# EAGLE design Servos Board (EAGLE 6.5.0)
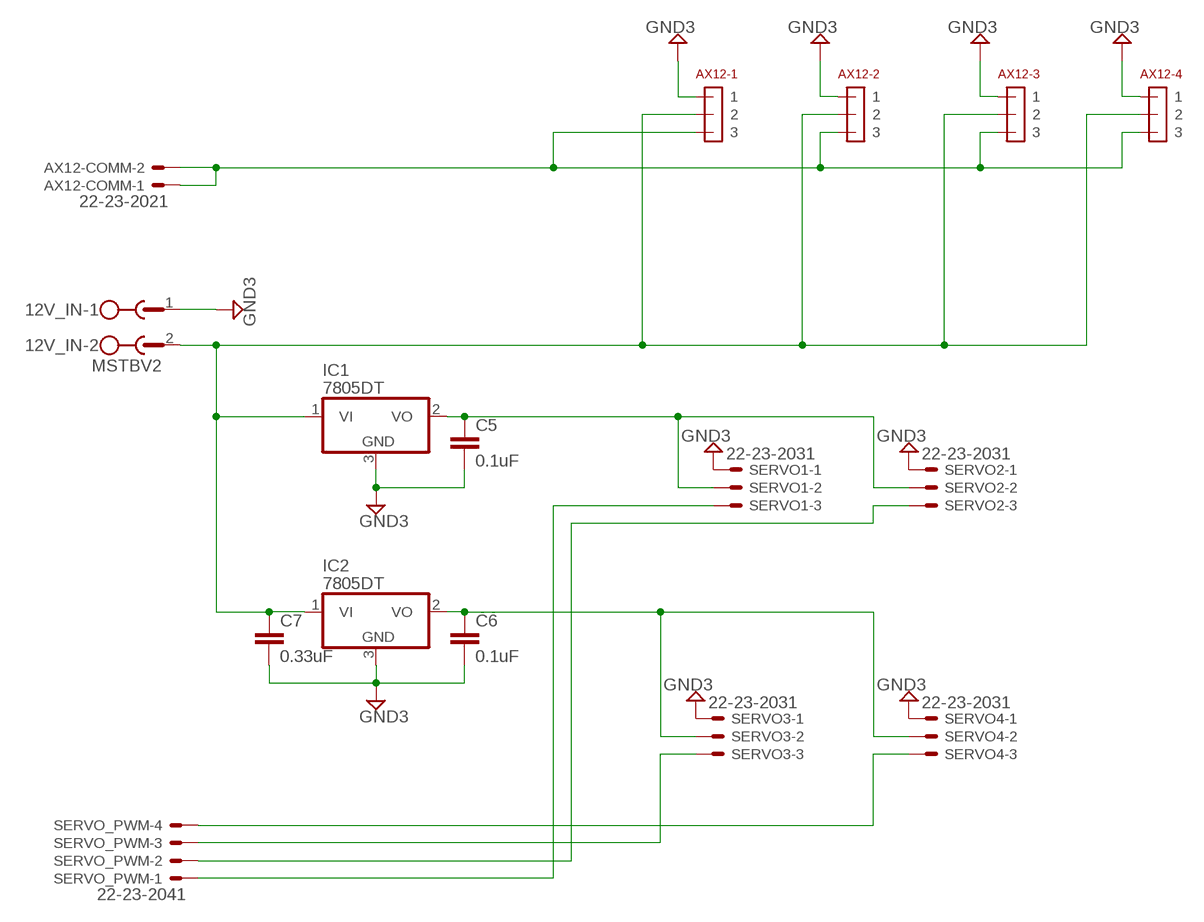
[diagram p0: schematic, sheet 1]

## Parts
12V_IN  MSTBV2  [MSTBV2]
AX12-1  22-03-5035  [22-03-5035]
AX12-2  22-03-5035  [22-03-5035]
AX12-3  22-03-5035  [22-03-5035]
AX12-4  22-03-5035  [22-03-5035]
AX12-COMM  22-23-2021  [22-23-2021]
C5  0.1uF  C-EUC0603  [C0603]
C6  0.1uF  C-EUC0603  [C0603]
C7  0.33uF  C-EUC0603  [C0603]
IC1  7805DT  [TO252]
IC2  7805DT  [TO252]
SERVO1  22-23-2031  [22-23-2031]
SERVO2  22-23-2031  [22-23-2031]
SERVO3  22-23-2031  [22-23-2031]
SERVO4  22-23-2031  [22-23-2031]
SERVO_PWM  22-23-2041  [22-23-2041]

## Nets
GND3: 12V_IN.1 AX12-1.P$1 AX12-2.P$1 AX12-3.P$1 AX12-4.P$1 C5.2 C6.2 C7.2 IC1.3(GND) IC2.3(GND) SERVO1.1 SERVO2.1 SERVO3.1 SERVO4.1
N$33: SERVO1.3 SERVO_PWM.1
N$34: SERVO2.3 SERVO_PWM.2
N$35: SERVO3.3 SERVO_PWM.3
N$36: C6.1 IC2.2(VO) SERVO3.2 SERVO4.2
N$37: SERVO4.3 SERVO_PWM.4
N$38: 12V_IN.2 AX12-1.P$2 AX12-2.P$2 AX12-3.P$2 AX12-4.P$2 C7.1 IC1.1(VI) IC2.1(VI)
N$39: C5.1 IC1.2(VO) SERVO1.2 SERVO2.2
N$40: AX12-1.P$3 AX12-2.P$3 AX12-3.P$3 AX12-4.P$3 AX12-COMM.1 AX12-COMM.2

## Library data of the parts
12V_IN = con-phoenix-508:MSTBV2: PHOENIX; MPN: MSTBV 2,5/2-GF-5.08; OC_FARNELL: 1792792; OC_NEWARK: 69R9845
AX12-1-AX12-4 = custom:22-03-5035
AX12-COMM = con-molex:22-23-2021: .100" (2.54mm) Center Header - 2 Pin; MF: MOLEX; MPN: 22-23-2021; OC_FARNELL: 1462926; OC_NEWARK: 25C3832
C5-C7 = rcl:C-EU: CAPACITOR, European symbol
IC1 IC2 = linear:78*: Positive VOLTAGE REGULATOR Source: http://cache.national.com/ds/LM/LM78L05.pdf http://www.fairchildsemi.com/ds/LM/LM7805.pdf
SERVO1-SERVO4 = con-molex:22-23-2031: .100" (2.54mm) Center Header - 3 Pin; MF: MOLEX; MPN: 22-23-2031; OC_FARNELL: 1462950; OC_NEWARK: 30C0862
SERVO_PWM = con-molex:22-23-2041: .100" (2.54mm) Center Header - 4 Pin; MF: MOLEX; MPN: 22-23-2041; OC_FARNELL: 1462920; OC_NEWARK: 38C0355

## Board
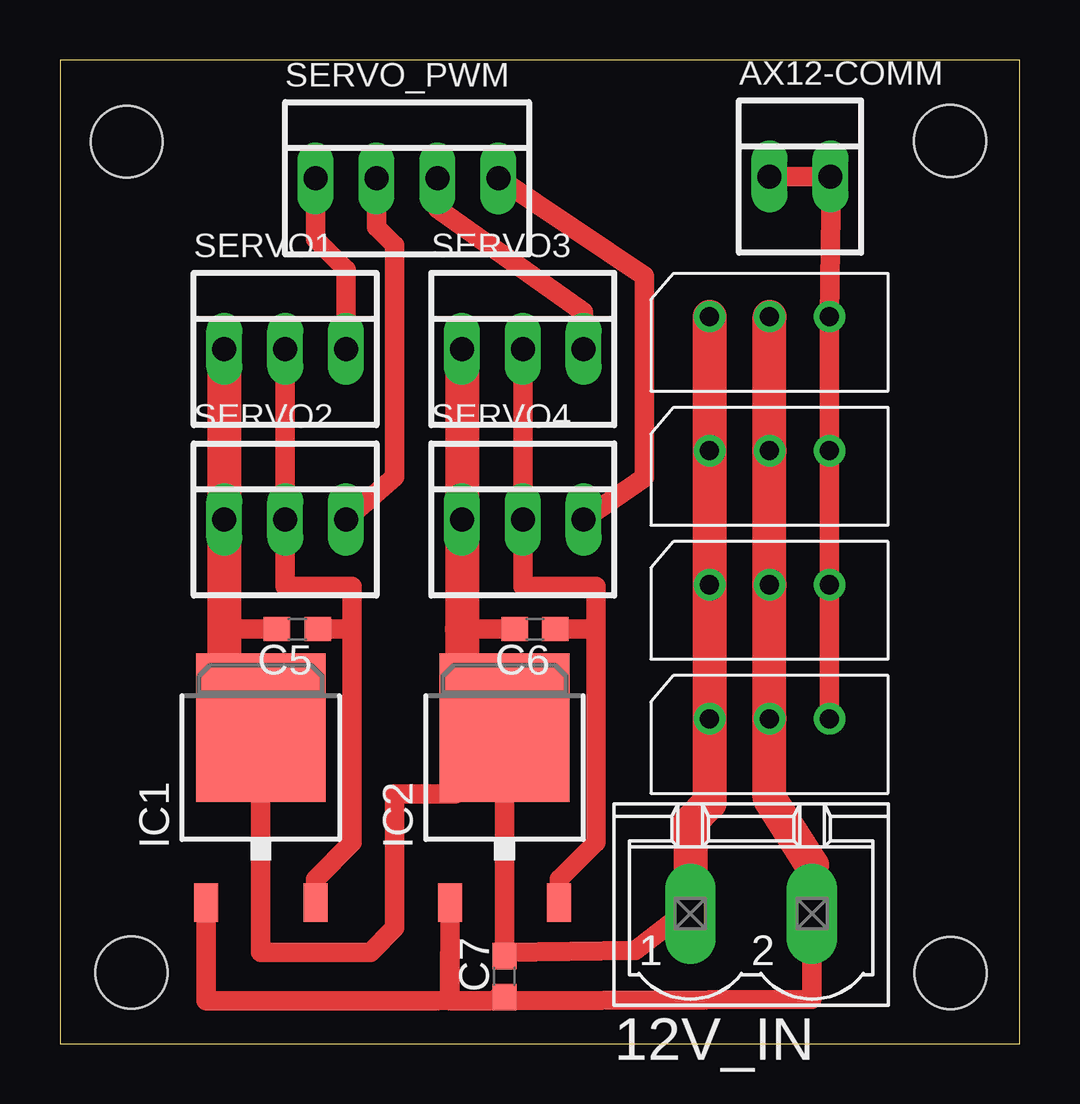
[diagram p1: board, top side]

Size 40 x 41 mm. Coordinates in mm from the lower left corner, seen from the top.
Outline: 0,0 40,0 40,41 0,41 0,0
Copper layers (1*16): Top 0.035mm / dielectric 1.5mm / Bottom 0.035mm
Design rules "default *": minimum track width 8mil, minimum drill 0.3mm, track to track 8mil, track to pad 8mil, pad to pad 8mil, via to via 8mil, smd to smd 8mil, copper to edge 40mil, drill to drill 8mil, minimum pad ring 10mil, minimum via ring 8mil, stop-mask expansion 4mil, vias tented up to drill 0mil, thermal gap 10mil
Holes 3 mm at 37.12,2.93 37.1,37.63 2.78,37.59 2.98,2.96

### Footprints (pad centres in the part's own frame; a part is rotated, then mirrored left to right if it is on the bottom)
MSTBV2 = drill 1.397 long: 1 -2.54,0; 2 2.54,0
22-03-5035 = drill 0.8: P$1 -2.5,0; P$2 0,0; P$3 2.5,0
22-23-2021 = drill 1 long: 1 -1.27,0; 2 1.27,0
C0603 = smd 1.1 x 1: 1 -0.85,0; 2 0.85,0
TO252 = smd 1 x 1.6: 1 -2.28,-4.8; 2 2.28,-4.8 | smd 5.4 x 6.2: 3 0,2.5
22-23-2031 = drill 1 long: 1 -2.54,0; 2 0,0; 3 2.54,0
22-23-2041 = drill 1 long: 1 -3.81,0; 2 -1.27,0; 3 1.27,0; 4 3.81,0

### Placement (x,y rotation side)
12V_IN  28.81,5.41 0 top
AX12-1  29.58,30.3 0 top
AX12-2  29.58,24.71 0 top
AX12-3  29.58,19.12 0 top
AX12-4  29.58,13.54 0 top
AX12-COMM  30.85,36.14 0 top
C5  9.89,17.27 180 top
C6  19.8,17.27 180 top
C7  18.53,2.79 90 top
IC1  8.37,10.67 0 top
IC2  18.53,10.67 0 top
SERVO1  9.39,28.96 0 top
SERVO2  9.39,21.84 0 top
SERVO3  19.29,28.96 0 top
SERVO4  19.29,21.84 0 top
SERVO_PWM  14.47,36.07 0 top

### Tracks (layer width: path | path; a pad name or v marks a point on that pad's centre or on a via)
GND3
  Top 0.813: C5.2 6.85,17.27 | C6.2 16.75,17.27 | 17.65,13.17 16.5,12.02 16.5,10.41 13.96,10.41 13.96,4.83 12.94,3.81 8.37,3.81 IC1.3 | 26.27,5.66 23.99,3.88 18.53,3.81 | 18.53,3.81 IC2.3 | C7.2 18.53,3.81
  Top 1.422: AX12-1.P$1 AX12-2.P$1 AX12-3.P$1 AX12-4.P$1 27.08,10.02 26.27,9.22 26.27,5.66 12V_IN.1 | SERVO3.1 SERVO4.1 16.75,17.27 16.75,13.42 17.65,13.17 IC2.3 | SERVO1.1 SERVO2.1 6.85,17.27 6.85,13.68 IC1.3
N$33
  Top 0.813: SERVO_PWM.1 10.66,33.53 11.93,32.26 SERVO1.3
N$34
  Top 0.813: SERVO_PWM.2 13.2,34.04 13.96,33.27 13.96,23.62 SERVO2.3
N$35
  Top 0.813: SERVO_PWM.3 15.74,34.8 21.83,30.48 SERVO3.3
N$36
  Top 0.813: SERVO3.2 SERVO4.2 19.29,19.05 22.34,19.05 22.34,17.27 | 22.34,17.27 22.34,8.38 20.82,6.86 20.82,6.13 IC2.2 | C6.1 22.34,17.27
N$37
  Top 0.813: SERVO4.3 24.37,23.6 24.37,31.98 SERVO_PWM.4
N$38
  Top 0.813: 12V_IN.2 31.35,1.85 18.28,1.78 | 18.28,1.78 16.25,1.78 IC2.1 16.24,1.8 15.74,1.78 6.09,1.78 IC1.1 | C7.1 18.28,1.94 18.28,1.78
  Top 1.422: 12V_IN.2 31.35,7.44 29.58,10.23 AX12-4.P$2 AX12-3.P$2 AX12-2.P$2 AX12-1.P$2
N$39
  Top 0.813: IC1.2 10.65,6.85 12.18,8.38 12.18,17.27 | 12.18,17.27 12.18,19.05 9.39,19.05 SERVO2.2 SERVO1.2 | C5.1 12.18,17.27
N$40
  Top 0.813: AX12-4.P$3 AX12-3.P$3 | AX12-1.P$3 32.16,36.1 AX12-COMM.2 AX12-COMM.1 | AX12-1.P$3 AX12-2.P$3 AX12-3.P$3 | AX12-3.P$3 AX12-1.P$3